# EAGLE design sparkfun-samd21g-r3 (EAGLE 7.1.0)
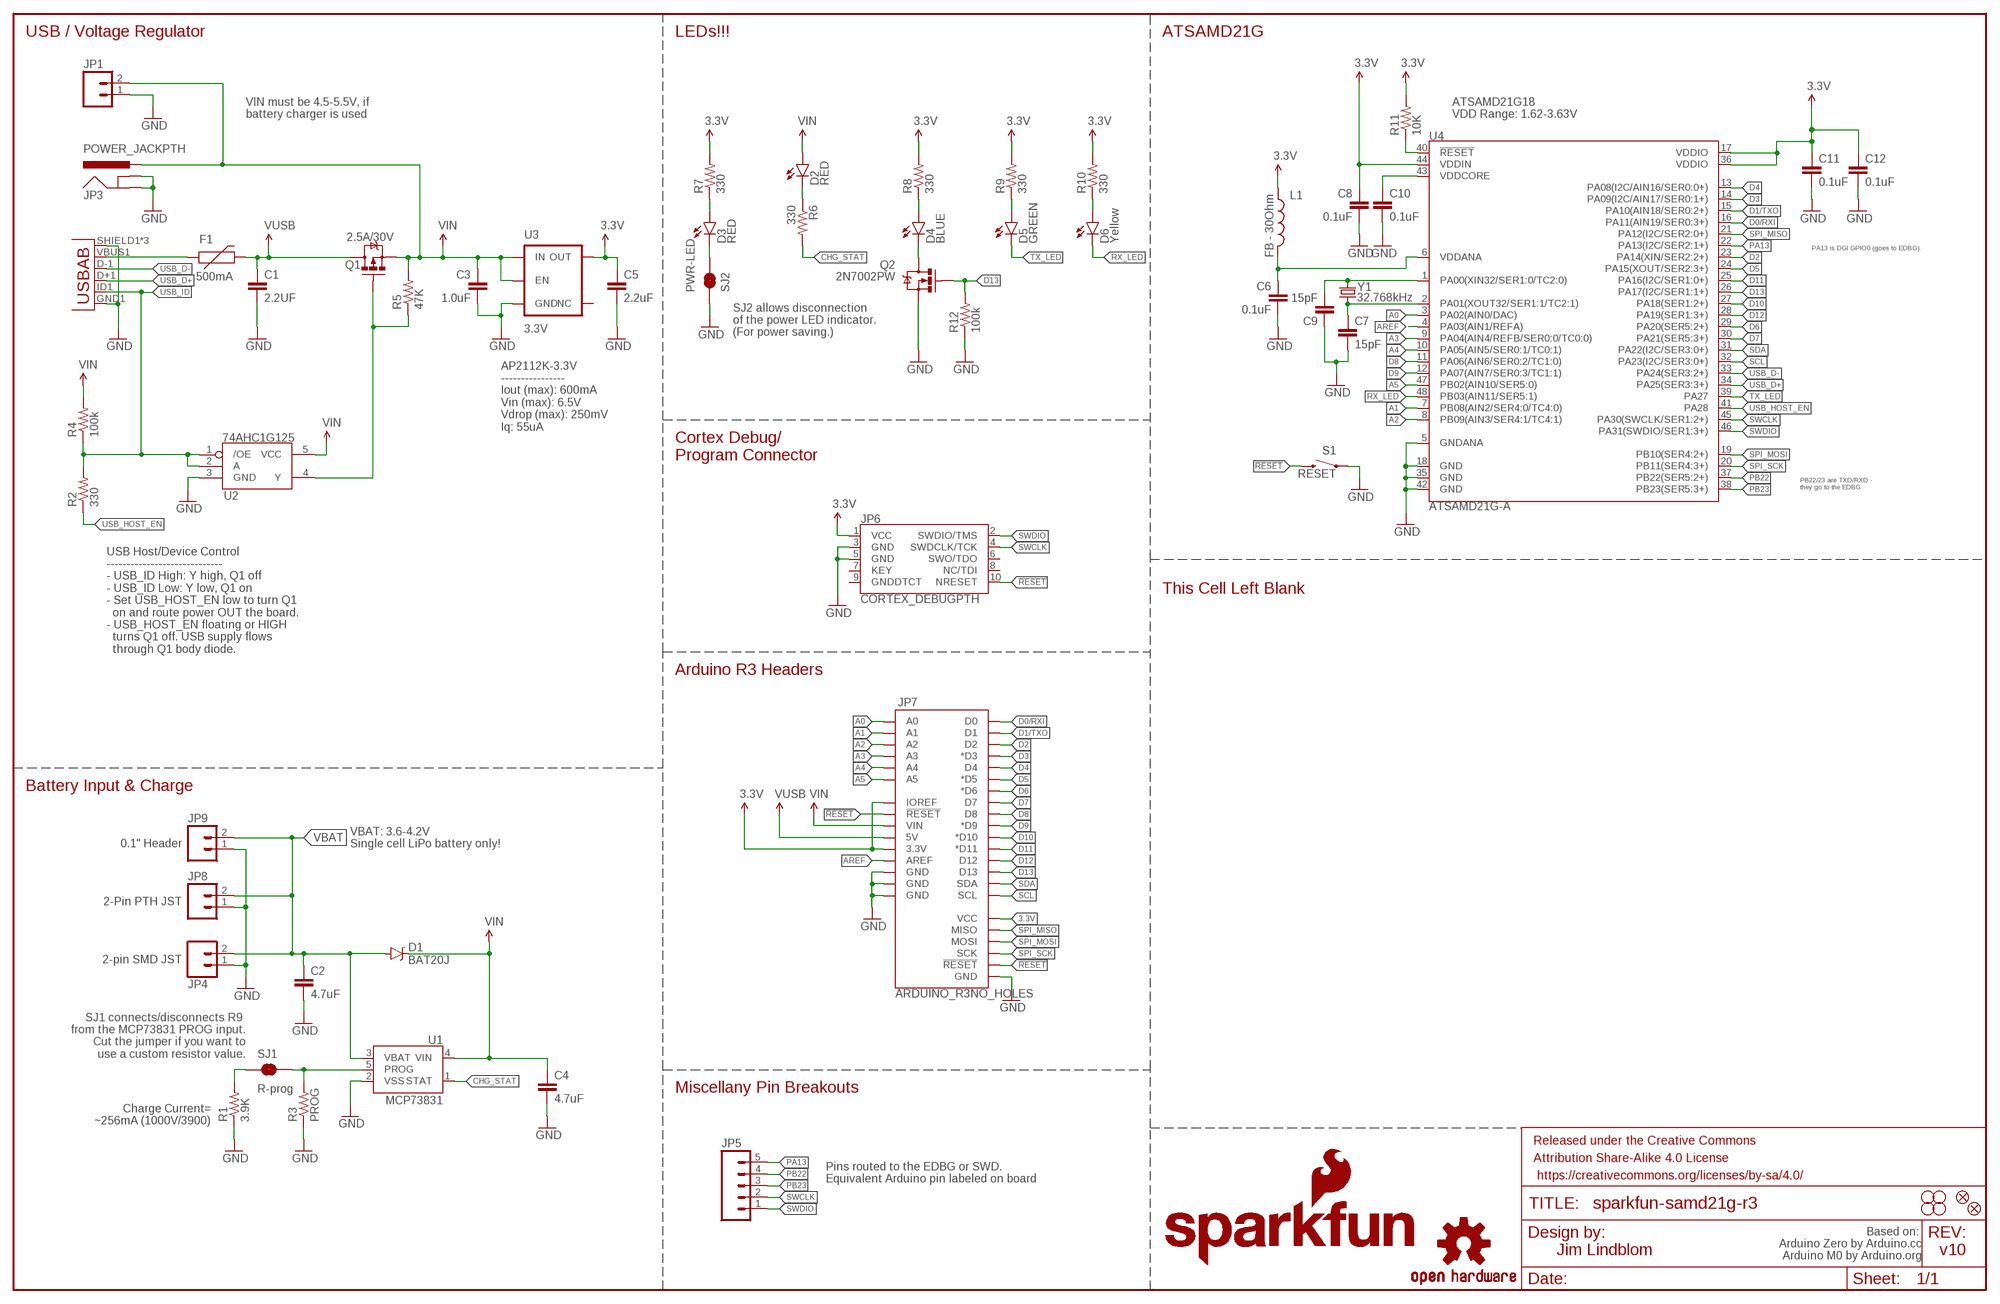
[diagram p0: schematic, sheet 1]

## Parts
C1  2.2UF  2.2UF50V10%(1206)  [1206]
C2  4.7uF  4.7UF-6.3V-10%(0603)0603  [0603-CAP]
C3  1.0uF  1.0UF-25V-+80/-20(0805)"  [0805-CAP]
C4  4.7uF  4.7UF-6.3V-10%(0603)0603  [0603-CAP]
C5  2.2uF  2.2UF-10V-20%(0603)  [0603-CAP]
C6  0.1uF  0.1UF-25V(+80/-20%)(0603)  [0603-CAP]
C7  15pF  15PF-50V-5%(0603)  [0603-CAP]
C8  0.1uF  0.1UF-25V(+80/-20%)(0603)  [0603-CAP]
C9  15pF  15PF-50V-5%(0603)  [0603-CAP]
C10  0.1uF  0.1UF-25V(+80/-20%)(0603)  [0603-CAP]
C11  0.1uF  0.1UF-25V(+80/-20%)(0603)  [0603-CAP]
C12  0.1uF  0.1UF-25V(+80/-20%)(0603)  [0603-CAP]
D1  BAT20J  DIODE-SCHOTTKY-BAT20J  [SOD-323]
D2  RED  LED-RED0603  [LED-0603]
D3  RED  LED-RED0603  [LED-0603]
D4  BLUE  LED-BLUE0603  [LED-0603]
D5  GREEN  LED-GREEN0603  [LED-0603]
D6  Yellow  LED-YELLOW0603  [LED-0603]
F1  500mA  PTCSMD  [PTC-1206]
FID1  FIDUCIAL1X2  [FIDUCIAL-1X2]
FID2  FIDUCIAL1X2  [FIDUCIAL-1X2]
FRAME1  FRAME-LEDGER  [CREATIVE_COMMONS]
JP1  M02PTH  [1X02]
JP2  USB-ABCONN-11794  [USB-AB-MICRO-SMD_V03]
JP3  POWER_JACKPTH  [POWER_JACK_PTH]
JP4  M02-JST-2MM-SMT  [JST-2-SMD]
JP5  M05NO_SILK  [1X05_NO_SILK]
JP6  CORTEX_DEBUGPTH  [2X5-PTH-1.27MM]
JP7  ARDUINO_R3NO_HOLES  [ARDUINO_R3_NO_HOLES]
JP8  M02-JST-2-PTH-NO_SILK  [JST-2-PTH-NS]
JP9  M021X02_NO_SILK  [1X02_NO_SILK]
L1  FB - 30Ohm  INDUCTOR0603  [0603]
LOGO1  SFE_LOGO_NAME_FLAME.2_INCH  [SFE_LOGO_NAME_FLAME_.2]
LOGO2  SFE_LOGO_NAME_FLAME.4_INCH  [SFE_LOGO_NAME_FLAME_.4]
LOGO3  OSHW-LOGOS  [OSHW-LOGO-S]
LOGO4  OSHW-LOGOL  [OSHW-LOGO-L]
Q1  2.5A/30V  MOSFET-PCHANNELDMG2307L  [SOT23-3]
Q2  2N7002PW  MOSFET-NCHANNEL2N7002PW  [SOT323]
R1  3.9K  3.9KOHM1/10W1%(0603)  [0603]
R2  330  330OHM1/10W1%(0603)  [0603-RES]
R3  PROG  RESISTORPTH-1/6W  [1/6W-RES]
R4  100k  100KOHM-1/10W-1%(0603)  [0603-RES]
R5  47K  47KOHM1/10W1%(0603)  [0603-RES]
R6  330  330OHM1/10W1%(0603)  [0603-RES]
R7  330  330OHM1/10W1%(0603)  [0603-RES]
R8  330  330OHM1/10W1%(0603)  [0603-RES]
R9  330  330OHM1/10W1%(0603)  [0603-RES]
R10  330  330OHM1/10W1%(0603)  [0603-RES]
R11  10K  10KOHM-1/10W-1%(0603)0603  [0603-RES]
R12  100k  100KOHM-1/10W-1%(0603)  [0603-RES]
S1  RESET  SWITCH-MOMENTARY-2SMD  [TACTILE-SWITCH-SMD]
SJ1  R-prog  JUMPER-PAD-2-NC_BY_TRACE  [PAD-JUMPER-2-NC_BY_TRACE_YES_SILK]
SJ2  PWR-LED  JUMPER-PAD-2-NC_BY_TRACENO_SILK  [PAD-JUMPER-2-NC_BY_TRACE_NO_SILK]
STANDOFF1  STAND-OFF  [STAND-OFF]
STANDOFF2  STAND-OFF  [STAND-OFF]
STANDOFF3  STAND-OFF  [STAND-OFF]
STANDOFF4  STAND-OFF  [STAND-OFF]
U1  MCP73831  [SOT23-5]
U2  74AHC1G125  [SOT23-5]
U3  3.3V  V_REG_AP2112K-3.3V  [SOT23-5]
U4  ATSAMD21G-A  [TQFP-48]
Y1  32.768kHz  CRYSTAL3.2X1.5MM  [CRYSTAL-SMD-3.2X1.5MM]

## Nets
3.3V: C5.1 C8.1 C11.1 C12.1 JP6.1(VCC) JP7.3.3V JP7.IOREF JP7.VCC L1.1 R7.2 R8.2 R9.2 R10.2 R11.2 U3.5(OUT) U4.17(VDDIO) U4.36(VDDIO) U4.44(VDDIN)
!RESET: JP6.10(NRESET) JP7.RESET@1(!RESET!) JP7.RESET@2(!RESET!) R11.1 S1.3 U4.40(!RESET!)
A0: JP7.A0 U4.3(PA02(AIN0/DAC))
A1: JP7.A1 U4.7(PB08(AIN2/SER4:0/TC4:0))
A2: JP7.A2 U4.8(PB09(AIN3/SER4:1/TC4:1))
A3: JP7.A3 U4.9(PA04(AIN4/REFB/SER0:0/TC0:0))
A4: JP7.A4 U4.10(PA05(AIN5/SER0:1/TC0:1))
A5: JP7.A5 U4.47(PB02(AIN10/SER5:0))
AREF: JP7.AREF U4.4(PA03(AIN1/REFA))
CHG_STAT: R6.2 U1.1(STAT)
D0/RXI: JP7.D0 U4.16(PA11(AIN19/SER0:3+))
D1/TXO: JP7.D1 U4.15(PA10(AIN18/SER0:2+))
D2: JP7.D2 U4.23(PA14(XIN/SER2:2+))
D3: JP7.D3(*D3) U4.14(PA09(I2C/AIN17/SER0:1+))
D4: JP7.D4 U4.13(PA08(I2C/AIN16/SER0:0+))
D5: JP7.D5(*D5) U4.24(PA15(XOUT/SER2:3+))
D6: JP7.D6(*D6) U4.29(PA20(SER5:2+))
D7: JP7.D7 U4.30(PA21(SER5:3+))
D8: JP7.D8 U4.11(PA06(AIN6/SER0:2/TC1:0))
D9: JP7.D9(*D9) U4.12(PA07(AIN7/SER0:3/TC1:1))
D10: JP7.D10(*D10) U4.27(PA18(SER1:2+))
D11: JP7.D11(*D11) U4.25(PA16(I2C/SER1:0+))
D12: JP7.D12 U4.28(PA19(SER1:3+))
D13: JP7.D13 Q2.1(G) R12.2 U4.26(PA17(I2C/SER1:1+))
GND: C1.2 C2.2 C3.2 C4.2 C5.2 C6.2 C7.2 C8.2 C9.1 C10.2 C11.2 C12.2 JP1.1 JP2.GND1(GND) JP2.SHIELD1(SHIELD) JP2.SHIELD2(SHIELD) JP2.SHIELD3(SHIELD) JP3.GND JP3.GNDBREAK JP4.1 JP6.3(GND) JP6.5(GND) JP7.GND@1(GND) JP7.GND@2(GND) JP7.GND@3(GND) JP7.GND@4(GND) JP8.1 JP9.1 Q2.2(S) R1.1 R3.1 R12.1 S1.1 SJ2.1 U1.2(VSS) U2.3(GND) U3.2(GND) U4.5(GNDANA) U4.18(GND) U4.35(GND) U4.42(GND)
N$1: F1.1 JP2.VBUS1(VBUS)
N$2: C9.2 U4.1(PA00(XIN32/SER1:0/TC2:0)) Y1.P$2
N$3: D4.C Q2.3(D)
N$4: C7.1 U4.2(PA01(XOUT32/SER1:1/TC2:1)) Y1.P$1
N$5: D3.A R7.1
N$6: D4.A R8.1
N$8: D2.C R6.1
N$10: D5.A R9.1
N$11: D6.A R10.1
N$12: D3.C SJ2.2
N$13: R1.2 SJ1.1
N$15: R3.2 SJ1.2 U1.5(PROG)
PA13: JP5.5 U4.22(PA13(I2C/SER2:1+))
PB22: JP5.4 U4.37(PB22(SER5:2+))
PB23: JP5.3 U4.38(PB23(SER5:3+))
RX_LED: D6.C U4.48(PB03(AIN11/SER5:1))
SCL: JP7.SCL U4.32(PA23(I2C/SER3:0+))
SDA: JP7.SDA U4.31(PA22(I2C/SER3:0+))
SPI_MISO: JP7.MISO U4.21(PA12(I2C/SER2:0+))
SPI_MOSI: JP7.MOSI U4.19(PB10(SER4:2+))
SPI_SCK: JP7.SCK U4.20(PB11(SER4:3+))
SWCLK: JP5.2 JP6.4(SWDCLK/TCK) U4.45(PA30(SWCLK/SER1:2+))
SWDIO: JP5.1 JP6.2(SWDIO/TMS) U4.46(PA31(SWDIO/SER1:3+))
TX_LED: D5.C U4.39(PA27)
USB_D+: JP2.D+1(D+) U4.34(PA25(SER3:3+))
USB_D-: JP2.D-1(D-) U4.33(PA24(SER3:2+))
USB_HOST_EN: R2.1 U4.41(PA28)
USB_HOST_POWER_EN: Q1.1(G) R5.1 U2.4(Y)
USB_ID: JP2.ID1(USBID) R2.2 R4.1 U2.1(/OE) U2.2(A)
VBAT: C2.1 D1.A JP4.2 JP8.2 JP9.2 U1.3(VBAT)
VDDANA: C6.1 L1.2 U4.6(VDDANA)
VDDCORE: C10.1 U4.43(VDDCORE)
VIN: C3.1 C4.1 D1.C D2.A JP1.2 JP3.PWR JP7.VIN Q1.2(S) R4.2 R5.2 U1.4(VIN) U2.5(VCC) U3.1(IN) U3.3(EN)
VUSB: C1.1 F1.2 JP7.5V Q1.3(D)
Unconnected: JP6.6(SWO/TDO) JP6.7(KEY) JP6.8(NC/TDI) JP6.9(GNDDTCT) U3.4(NC)

## Notes on the sheet
- USB / Voltage Regulator | LEDs!!! | ATSAMD21G
- VIN must be 4.5-5.5V, if 
  battery charger is used
- ATSAMD21G18
  VDD Range: 1.62-3.63V
- PA13 is DGI GPIO0 (goes to EDBG).
- SJ2 allows disconnection
  of the power LED indicator.
  (For power saving.)
- AP2112K-3.3V
  ----------------
  Iout (max): 600mA 
  Vin (max): 6.5V
  Vdrop (max): 250mV
  Iq: 55uA
- Cortex Debug/
  Program Connector
- PB22/23 are TXD/RXD - 
  they go to the EDBG
- USB Host/Device Control
  -----------------------------
  - USB_ID High: Y high, Q1 off
  - USB_ID Low: Y low, Q1 on
  - Set USB_HOST_EN low to turn Q1
    on and route power OUT the board.
  - USB_HOST_EN floating or HIGH
    turns Q1 off. USB supply flows
    through Q1 body diode.
- This Cell Left Blank
- Arduino R3 Headers
- Battery Input & Charge
- VBAT: 3.6-4.2V
  Single cell LiPo battery only\!
- 0.1" Header
- 2-Pin PTH JST
- 2-pin SMD JST
- SJ1 connects/disconnects R9 
  from the MCP73831 PROG input.
  Cut the jumper if you want to
  use a custom resistor value.
- Miscellany Pin Breakouts
- Charge Current=
  ~256mA (1000V/3900)
- Pins routed to the EDBG or SWD.
  Equivalent Arduino pin labeled on board
- Based on: 
  Arduino Zero by Arduino.cc
  Arduino M0 by Arduino.org
- Jim Lindblom | v10

## Library data of the parts
C1 = SparkFun-Capacitors:2.2UF50V10%(1206): CAP-10009; PROD_ID: CAP-10009
C2 C4 = SparkFun-Capacitors:4.7UF-6.3V-10%(0603): CAP-08280; PROD_ID: CAP-08280
C3 = SparkFun-Capacitors:1.0UF-25V-+80/-20(0805): CAP-11625; PROD_ID: CAP-11625
C5 = SparkFun-Capacitors:2.2UF-10V-20%(0603): CAP-07888; PROD_ID: CAP-07888
C6 C8 C10-C12 = SparkFun-Capacitors:0.1UF-25V(+80/-20%)(0603): CAP-00810 Ceramic Standard decoupling cap; PROD_ID: CAP-00810
C7 C9 = SparkFun-Capacitors:15PF-50V-5%(0603): CAP-07881; PROD_ID: CAP-07881
D1 = SparkFun-DiscreteSemi:DIODE-SCHOTTKY: Schottky diodes in SFE's production catalog BAT20J 1A 23V 0.62Vf RB751 120mA 40V 0.37Vf PMEG4005EJ 0.5A 40V 0.42Vf MBRA140 1A 40V 0.5Vf B340A 3A 40V SMA; PROD_ID: DIO-11623
D2 D3 = SparkFun-LED:LED-RED: Assorted Red LEDs LilyPad 1206- DIO-09912 1206- DIO-00809 0603- DIO-00819 "SMART" means more efficient and expensive; PROD_ID: DIO-00819
D4 = SparkFun-LED:LED-BLUE: Blue LEDs for production use Various blue LEDs stocked by SparkFun production 0603 - DIO-08575 Rebel - DIO-09553 1206 - DIO-09911; PROD_ID: DIO-08575
D5 = SparkFun-LED:LED-GREEN: Various green LEDs Green LEDs used in SFE Production 0603- DIO-00821 LARGE- DIO-00862 LILYPAD- DIO-09910; PROD_ID: DIO-00821
D6 = SparkFun-LED:LED-YELLOW: Yellow SMD LEDs LilyPad 1206- DIO-09909 0603- DIO-09003 "SMART" means more efficient and expensive; PROD_ID: DIO-09003
F1 = SparkFun-PowerIC:PTC: Resettable Fuse PTC Resettable Fuse. Spark Fun Electronics SKU : COM-08357; PROD_ID: RES-11150
FID1 FID2 = SparkFun-Aesthetics:FIDUCIAL: Fiducial Alignment Points Various fiducial points for machine vision alignment.
FRAME1 = SparkFun-Aesthetics:FRAME-LEDGER: Schematic Frame Standard 11x14 US Ledger frame
JP1 JP8 JP9 = SparkFun-Connectors:M02: Standard 2-pin 0.1" header. Use with - straight break away headers ( PRT-00116) - right angle break away headers (PRT-00553) - swiss pins (PRT-00743) - machine pins (PRT-00117) - female headers (PRT-00115) Molex polarized connector foot print use with: PRT-08233 with associated crimp pins and housings. 2.54_SCREWTERM for use with PRT-10571. 3.5mm Screw Terminal footprints for PRT-08084 5mm Screw Terminal footprints for use with PRT-08432
JP2 = SparkFun-Connectors:USB-AB: This is a USB AB connector that is compatible with USB OTG. i.e. this connector can serve as a host or device; PROD_ID: CONN-11794
JP3 = SparkFun-Connectors:POWER_JACK: Power Jack This is the standard 5.5mm barrel jack for power. The PTH is the most common, proven, reliable, footprint. The Slot footprint only works if the mill layer is transmitted to the PCB fab house so be warned. Mating wall wart : TOL-00298 (and others); PROD_ID: CONN-08197
JP4 = SparkFun-Connectors:M02: Standard 2-pin 0.1" header. Use with - straight break away headers ( PRT-00116) - right angle break away headers (PRT-00553) - swiss pins (PRT-00743) - machine pins (PRT-00117) - female headers (PRT-00115) Molex polarized connector foot print use with: PRT-08233 with associated crimp pins and housings. 2.54_SCREWTERM for use with PRT-10571. 3.5mm Screw Terminal footprints for PRT-08084 5mm Screw Terminal footprints for use with PRT-08432; PROD_ID: CONN-11443
JP5 = SparkFun-Connectors:M05: Header 5 Standard 5-pin 0.1" header. Use with straight break away headers (SKU : PRT-00116), right angle break away headers (PRT-00553), swiss pins (PRT-00743), machine pins (PRT-00117), and female headers (PRT-00115). Molex polarized connector foot print use with SKU : PRT-08230 with associated crimp pins and housings.
JP6 = samd21-temp:CORTEX_DEBUG: Cortex Debug Connector Datasheet <http://infocenter.arm.com/help/topic/com.arm.doc.faqs/attached/13634/cortex_debug_connectors.pdf>
JP7 = SparkFun-Boards:ARDUINO_R3: Arduino R3 Footprint (w/ SPI header)
L1 = SparkFun-Passives:INDUCTOR: Inductors Basic Inductor/Choke - 0603 and 1206. Footprints are not proven and vary greatly between part numbers. INDUCTOR POWER 3.3UH 4.0A SMD 0.197" L x 0.197" W x 0.177" H (5.00mm x 5.00mm x 4.50mm); PROD_ID: RES-07859
LOGO1 LOGO2 = SparkFun-Aesthetics:SFE_LOGO_NAME_FLAME: SFE Logo, name and flame This is the SparkFun full logo. The logo on the schematic will always be the same size; the package variant is the height of the flame part of the logo. Default layer for the logo on the board is tSilk.
LOGO3 LOGO4 = SparkFun-Aesthetics:OSHW-LOGO: Open Source Hardware Logo This logo indicates the piece of hardware it is found on incorporates a OSHW license and/or adheres to the definition of open source hardware found here: http://freedomdefined.org/OSHW
Q1 = SparkFun-DiscreteSemi:MOSFET-PCHANNEL: Generic PMOSFET IRLML2244 - TRANS-11153 (SOT-23 -20V -4.3A) (1.Gate 2.Source 3.Drain) FQP27P06 - COM-10349 <http://www.sparkfun.com/products/10349> (TO-220 -60V -27A) (1.Gate 2.Source 3.Drain); PROD_ID: TRANS-11308
Q2 = SparkFun-DiscreteSemi:MOSFET-NCHANNEL: Common NMOSFET Parts MFG P/N Store ID Prod ID FDD8780 TRANS-09984 SI7820DN TRANS-11055 FDS6630A IC-08089 2N7002PW TRANS-11151 FQP30N06L COM-10213 TRANS-10060 BSS123LT1G TRANS-08345 BSS138 TRANS-00830 BS170 2N7000; PROD_ID: TRANS-11151
R1 = SparkFun-Resistors:3.9KOHM1/10W1%(0603): RES-08701; PROD_ID: RES-08701
R2 R6-R10 = SparkFun-Resistors:330OHM1/10W1%(0603): RES-00818; PROD_ID: RES-00818
R3 = SparkFun-Passives:RESISTOR: Resistor Basic schematic elements and footprints for 0603, 1206, and PTH resistors.
R4 R12 = SparkFun-Resistors:100KOHM-1/10W-1%(0603): RES-07828; PROD_ID: RES-07828
R5 = SparkFun-Resistors:47KOHM1/10W1%(0603): RES-07871; PROD_ID: RES-07871
R11 = SparkFun-Resistors:10KOHM-1/10W-1%(0603): RES-00824; PROD_ID: RES-00824
S1 = SparkFun-Electromechanical:SWITCH-MOMENTARY-2: Various NO switches- pushbuttons, reed, etc; PROD_ID: SWCH-08247
SJ1 SJ2 = SparkFun-Passives:JUMPER-PAD-2-NC_BY_TRACE
STANDOFF1-STANDOFF4 = SparkFun-Electromechanical:STAND-OFF: #4 Stand Off This is the mechanical footprint for a #4 phillips button head screw. Use the keepout ring to avoid running the screw head into surrounding components. SKU : PRT-00447
U1 = SparkFun-PowerIC:MCP73831: Miniature single cell, fully integrated Li-Ion, Li-polymer charge management controller http://ww1.microchip.com/downloads/en/DeviceDoc/20001984g.pdf IC-09995; PROD_ID: IC-09995
U2 = SparkFun-DigitalIC:74AHC1G125: Single bus buffer gate with 3-state output; PROD_ID: IC-11920
U3 = SparkFun-PowerIC:V_REG_AP2112: AP2112 - 600mA CMOS LDO Regulator w/ Enable The AP2112 is CMOS process low dropout linear regulator with enable function, the regulator delivers a guaranteed 600mA (min.) continuous load current. Features Output Voltage Accuracy: ±1.5% Output Current: 600mA (Min.) Foldback Short Current Protection: 50mA Enable Function to Turn ON/OFF VOUT Low Dropout Voltage (3.3V): 250mV (Typ.) @IOUT=600mA Excellent Load Regulation: 0.2%/A (Typ.) Excellent Line Regulation: 0.02%/V (Typ.) Low Quiescent Current: 55μA (Typ.) Low Standby Current: 0.01μA (Typ.) Low Output Noise: 50μVRMS PSRR: 100Hz -65dB, 1kHz -65dB OTSD Protection Stable with 1.0μF Flexible Cap: Ceramic, Tantalum and Aluminum Electrolytic Operation Temperature Range: -40°C to 85°C ESD: MM 400V, HBM 4000V; PROD_ID: VREG-12457
U4 = samd21-temp:ATSAMD21G: Atmel SAMD21G SMART ARM-Based Microcontroller The Atmel ® | SMART ™ SAM D21 is a series of low-power microcontrollers using the 32-bit ARM ® Cortex ® -M0+ processor, and ranging from 32- to 64-pins with up to 256KB Flash and 32KB of SRAM. The SAM D21 devices operate at a maximum frequency of 48MHz and reach 2.46 CoreMark/MHz. They are designed for simple and intuitive migration with identical peripheral modules, hex compatible code, identical linear address map and pin compatible migration paths between all devices in the product series. All devices include intelligent and flexible peripherals, Atmel Event System for inter-peripheral signaling, and support for capacitive touch button, slider and wheel user interfaces.; PROD_ID: IC-13064
Y1 = samd21-temp:CRYSTAL: Various standard crystals. Proven footprints.; PROD_ID: XTAL-13062

## Board
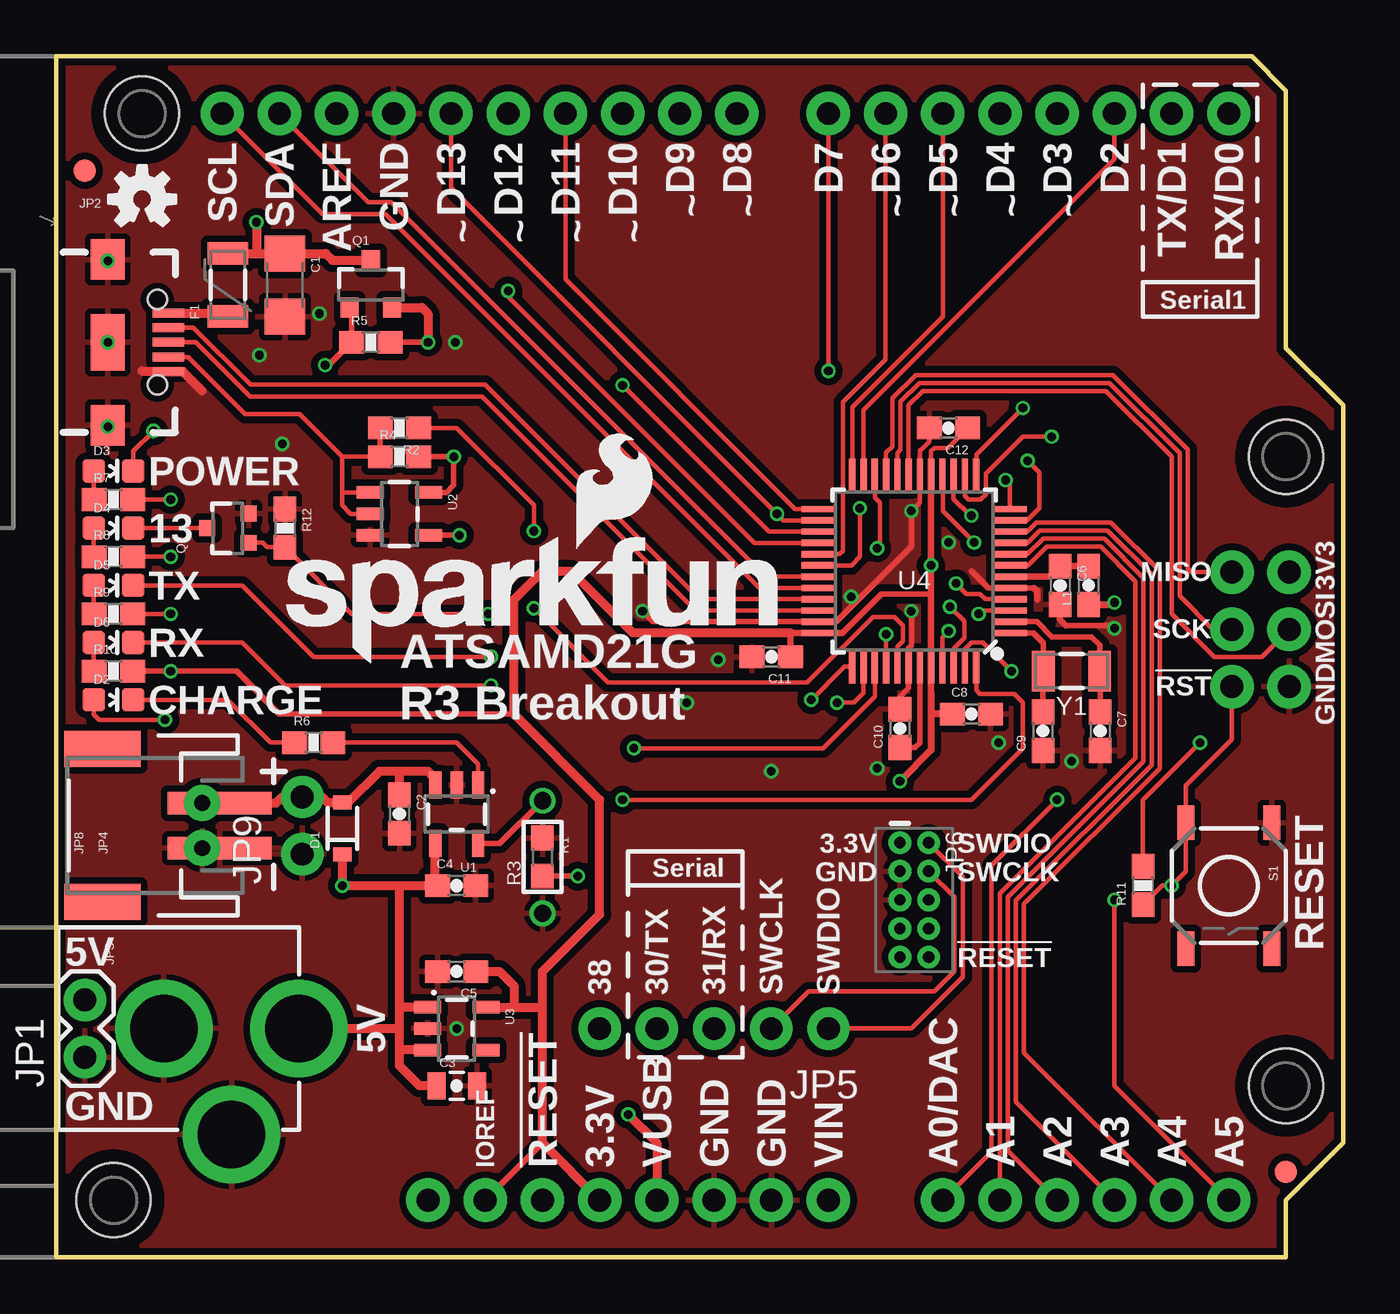
[diagram p1: board, top side]
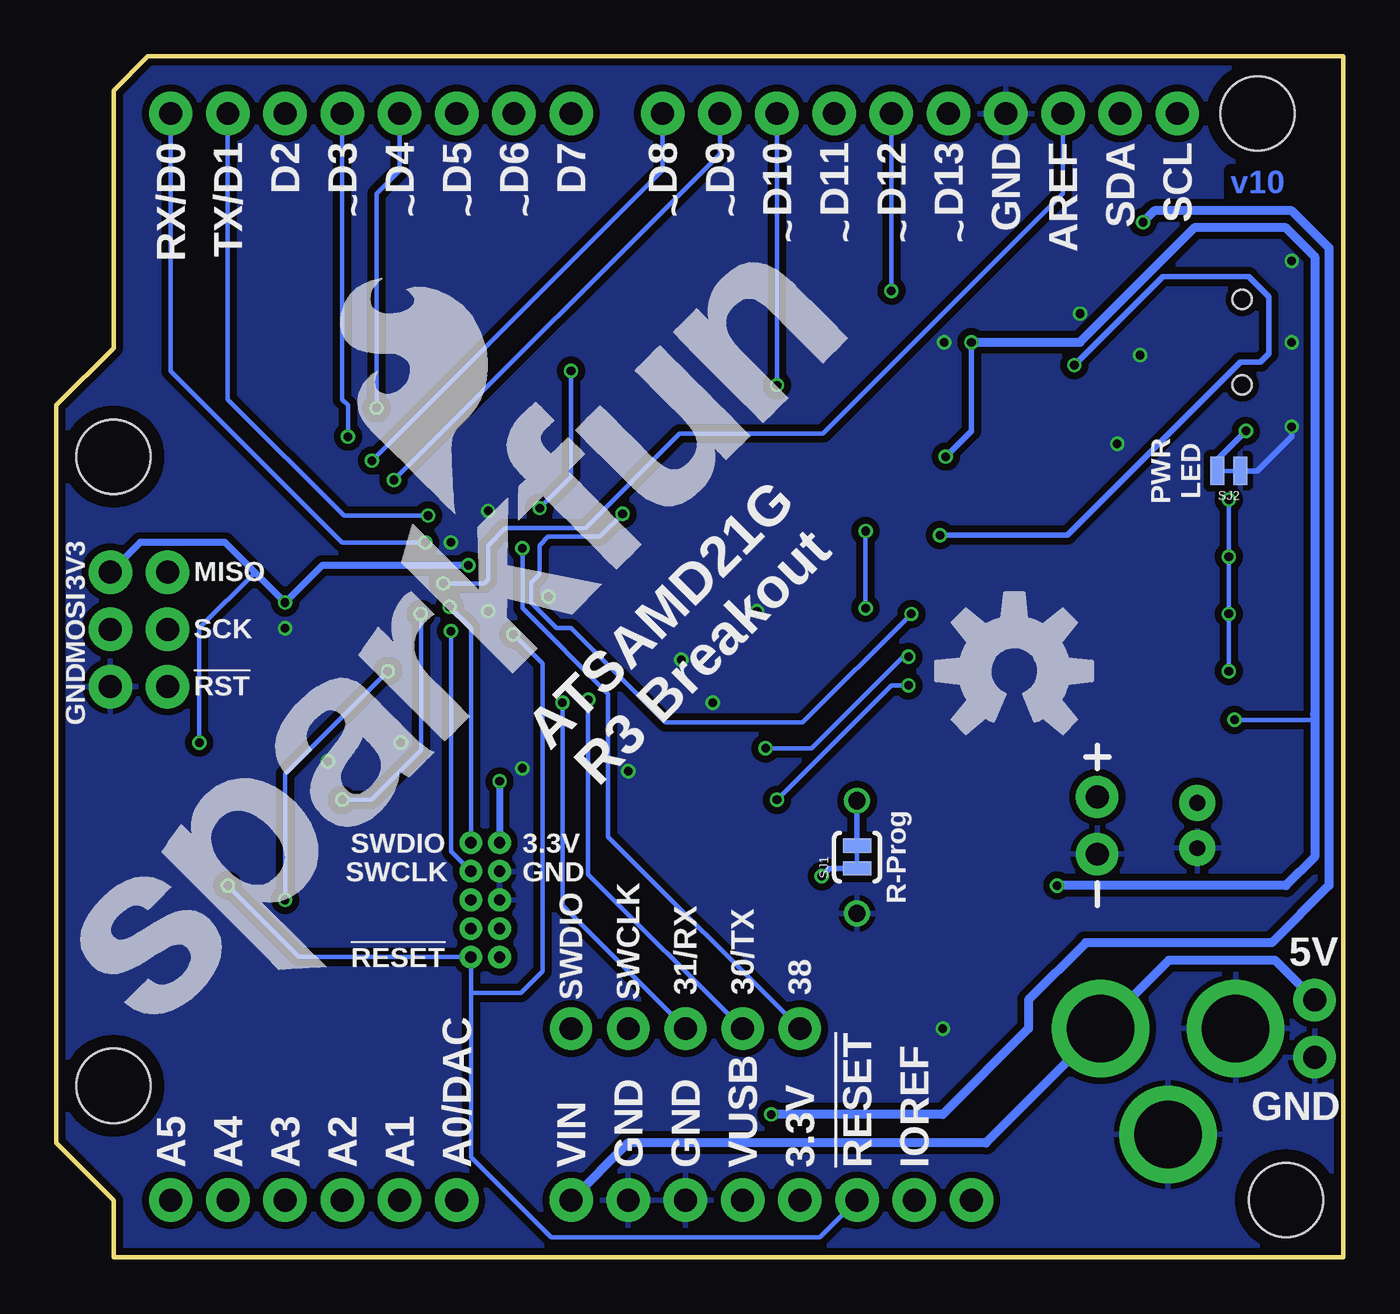
[diagram p2: board, bottom side, seen from below]

Size 57.15 x 53.34 mm. Coordinates in mm from the lower left corner, seen from the top.
Outline: 0,53.34 0,0 54.61,0 54.61,2.54 57.15,5.08 57.15,37.85 54.61,40.39 54.61,51.82 53.09,53.34 0,53.34
Copper layers (1*16): Top 0.035mm / dielectric 1.5mm / Bottom 0.035mm
Design rules "Gold_Phoenix_Standard_Spec_2_layer": minimum track width 5mil, minimum drill 6mil, track to track 5mil, track to pad 5mil, pad to pad 5mil, via to via 5mil, smd to smd 5mil, copper to edge 8mil, drill to drill 8mil, minimum pad ring 5mil, minimum via ring 5mil, stop-mask expansion 4mil, vias tented up to drill 20mil, thermal gap 10mil

### Footprints (pad centres in the part's own frame; a part is rotated, then mirrored left to right if it is on the bottom)
1206 = smd 1.6 x 1.8: 1 -1.4,0; 2 1.4,0
0603-CAP = smd 1.1 x 1: 1 -0.85,0; 2 0.85,0
0805-CAP = smd 0.8 x 1.2: 1 -0.9,0; 2 0.9,0
SOD-323 = smd 0.63 x 0.83: A 1.15,0; C -1.15,0
LED-0603 = smd 1 x 1: A 0,-0.877; C 0,0.877
PTC-1206 = smd 1 x 1.8: 1 -1.4,0; 2 1.4,0
FIDUCIAL-1X2 = smd 1 x 1: 1 0,0
1X02 = drill 1.016 pad 1.88: 1 0,0; 2 2.54,0
USB-AB-MICRO-SMD_V03 = smd 1.4 x 0.4: D+1 2.7,0; D-1 2.7,0.65; GND1 2.7,-1.3; ID1 2.7,-0.65; VBUS1 2.7,1.3 | smd 1.5 x 1.8: SHIELD1 0,3.68; SHIELD3 0,-3.68 | smd 1.5 x 2.5: SHIELD2 0,0 | hole 0.85: 2.2,1.9; 2.2,-1.9
POWER_JACK_PTH = drill 2.997 pad 4.318: GND 0,7.7; GNDBREAK 4.7,10.7; PWR 0,13.7
JST-2-SMD = smd 1 x 4.6: 1 -1,-3.7; 2 1,-3.7 | smd 1.6 x 3.4: NC1 -3.4,1.5; NC2 3.4,1.5
1X05_NO_SILK = drill 1.016 pad 1.88: 1 0,0; 2 2.54,0; 3 5.08,0; 4 7.62,0; 5 10.16,0
2X5-PTH-1.27MM = drill 0.508 pad 1: 1 -2.54,-0.635; 2 -2.54,0.635; 3 -1.27,-0.635; 4 -1.27,0.635; 5 0,-0.635; 6 0,0.635; 7 1.27,-0.635; 8 1.27,0.635; 9 2.54,-0.635; 10 2.54,0.635
ARDUINO_R3_NO_HOLES = drill 1.016 pad 1.93: 3.3V 35.56,2.54; 5V 38.1,2.54; A0 50.8,2.54; A1 53.34,2.54; A2 55.88,2.54; A3 58.42,2.54; A4 60.96,2.54; A5 63.5,2.54; AREF 23.876,50.8; D0 63.5,50.8; D1 60.96,50.8; D2 58.42,50.8; D3 55.88,50.8; D4 53.34,50.8; D5 50.8,50.8; D6 48.26,50.8; D7 45.72,50.8; D8 41.656,50.8; D9 39.116,50.8; D10 36.576,50.8; D11 34.036,50.8; D12 31.496,50.8; D13 28.956,50.8; GND@1 40.64,2.54; GND@2 43.18,2.54; GND@3 26.416,50.8; GND@4 66.18,25.35; IOREF 30.48,2.54; MISO 63.64,30.43; MOSI 66.18,27.89; NC 27.94,2.54; RESET@1 33.02,2.54; RESET@2 63.64,25.35; SCK 63.64,27.89; SCL 18.796,50.8; SDA 21.336,50.8; VCC 66.18,30.43; VIN 45.72,2.54
JST-2-PTH-NS = drill 0.7 pad 1.6: 1 -1,0; 2 1,0
1X02_NO_SILK = drill 1.016 pad 1.88: 1 0,0; 2 2.54,0
0603 = smd 1.1 x 1: 1 -0.85,0; 2 0.85,0
SOT23-3 = smd 0.8 x 0.9: 1 -0.95,-1; 2 0.95,-1; 3 0,1.1
SOT323 = smd 0.7 x 0.7: 1 -0.65,-0.925; 2 0.65,-0.925; 3 0,0.925
0603-RES = smd 1.1 x 1: 1 -0.85,0; 2 0.85,0
1/6W-RES = drill 0.762: 1 -2.5,0; 2 2.5,0
TACTILE-SWITCH-SMD = smd 1.524 x 0.762: 1 -2.794,1.905; 2 2.794,1.905; 3 -2.794,-1.905; 4 2.794,-1.905
PAD-JUMPER-2-NC_BY_TRACE_YES_SILK = smd 0.635 x 1.27: 1 -0.508,0; 2 0.508,0
PAD-JUMPER-2-NC_BY_TRACE_NO_SILK = smd 0.635 x 1.27: 1 -0.508,0; 2 0.508,0
STAND-OFF = hole 3.302: 0,0
SOT23-5 = smd 0.55 x 1.2: 1 -0.95,-1.3; 2 0,-1.3; 3 0.95,-1.3; 4 0.95,1.3; 5 -0.95,1.3
TQFP-48 = smd 1.5 x 0.28: 1 -4.25,2.75; 2 -4.25,2.25; 3 -4.25,1.75; 4 -4.25,1.25; 5 -4.25,0.75; 6 -4.25,0.25; 7 -4.25,-0.25; 8 -4.25,-0.75; 9 -4.25,-1.25; 10 -4.25,-1.75; 11 -4.25,-2.25; 12 -4.25,-2.75; 25 4.25,-2.75; 26 4.25,-2.25; 27 4.25,-1.75; 28 4.25,-1.25; 29 4.25,-0.75; 30 4.25,-0.25; 31 4.25,0.25; 32 4.25,0.75; 33 4.25,1.25; 34 4.25,1.75; 35 4.25,2.25; 36 4.25,2.75 | smd 0.28 x 1.5: 13 -2.75,-4.25; 14 -2.25,-4.25; 15 -1.75,-4.25; 16 -1.25,-4.25; 17 -0.75,-4.25; 18 -0.25,-4.25; 19 0.25,-4.25; 20 0.75,-4.25; 21 1.25,-4.25; 22 1.75,-4.25; 23 2.25,-4.25; 24 2.75,-4.25; 37 2.75,4.25; 38 2.25,4.25; 39 1.75,4.25; 40 1.25,4.25; 41 0.75,4.25; 42 0.25,4.25; 43 -0.25,4.25; 44 -0.75,4.25; 45 -1.25,4.25; 46 -1.75,4.25; 47 -2.25,4.25; 48 -2.75,4.25
CRYSTAL-SMD-3.2X1.5MM = smd 1 x 1.8: P$1 -1.25,0; P$2 1.25,0

### Placement (x,y rotation side)
C1  10.16,43.18 270 top
C2  15.24,19.68 270 top
C3  17.78,7.62 0 top
C4  17.78,16.51 0 top
C5  17.78,12.7 180 top
C6  44.58,29.84 270 top
C7  46.35,23.37 270 top
C8  40.64,24.13 0 top
C9  43.81,23.37 90 top
C10  37.47,23.5 90 top
C11  31.75,26.67 180 top
C12  39.62,36.83 180 top
D1  12.7,19.05 90 top
D2  2.54,24.77 270 top
D3  2.54,34.92 270 top
D4  2.54,32.38 270 top
D5  2.54,29.84 270 top
D6  2.54,27.3 270 top
F1  7.62,43.18 90 top
FID1  1.27,48.26 0 top
FID2  54.61,3.81 0 top
FRAME1  3.81,-29.21 0 top  (outside the outline)
JP1  1.27,8.89 90 top
JP2  2.29,40.64 0 top
JP3  -2.92,10.16 270 top
JP4  3.56,19.18 90 top
JP5  34.29,10.16 180 top
JP6  38.1,15.88 270 top
JP7  -11.43,0 0 top
JP8  6.48,19.18 90 top
JP9  10.92,17.91 90 top
L1  45.85,29.84 90 top
LOGO1  9.53,26.29 0 top
LOGO2  50.8,6.99 45 bottom
LOGO3  3.81,46.99 0 top
LOGO4  14.61,26.04 0 bottom
Q1  13.97,43.18 0 top
Q2  7.62,32.38 90 top
R1  21.59,17.78 270 top
R2  15.24,36.83 180 top
R3  21.59,17.78 90 top
R4  15.24,35.56 0 top
R5  13.97,40.64 0 top
R6  11.43,22.86 0 top
R7  2.54,33.66 0 top
R8  2.54,31.11 0 top
R9  2.54,28.57 0 top
R10  2.54,26.04 0 top
R11  48.26,16.51 90 top
R12  10.16,32.38 270 top
S1  52.07,16.51 270 top
SJ1  21.59,17.78 90 bottom
SJ2  5.08,34.92 180 bottom
STANDOFF1  54.61,7.62 0 top
STANDOFF2  3.81,50.8 0 top
STANDOFF3  2.54,2.54 0 top
STANDOFF4  54.61,35.56 0 top
U1  17.78,19.68 180 top
U2  15.24,33.02 270 top
U3  17.78,10.16 270 top
U4  38.1,30.48 180 top
Y1  45.09,26.04 180 top

### Tracks (layer width: path | path; a pad name or v marks a point on that pad's centre or on a via)
3.3V  (via drill 0.38)
  Top 0.203: U4.17 38.85,35.8 38.99,35.94 39.59,35.94 C12.1 | R11.2 48.26,20.32 v50.8,22.86 | R7.2 v5.08,33.66 | v5.08,31.11 R8.2 | R9.2 v5.08,28.57
  Top 0.254: 34.91,27.73 36.64,29.46 38.85,29.46 | 20.32,24.13 9.91,24.13 8,26.04 v5.08,26.04 R10.2 | JP7.IOREF 21.59,5.08
  Top 0.279: U4.17 v38.85,30.73 38.85,29.46 U4.44 38.85,25.07 | 34.91,27.73 U4.36 32.6,27.73 C11.1
  Top 0.305: L1.1 46.9,29 v46.99,29.08 | 38.85,25.07 38.85,24.13 | 38.85,24.13 38.85,22.53 v37.47,21.14 | C8.1 38.85,24.13
  Top 0.406: 32.6,27.73 25.61,27.73 22.86,30.48 21.59,30.48 20.32,29.21 20.32,24.13 24.13,20.32 24.13,15.24 21.59,12.7 21.59,11.11 | U3.5 20.32,11.11 | 20.32,11.11 21.59,11.11 | C5.1 19.68,12.7 20.32,12.06 20.32,11.11 | JP7.3.3V 21.59,5.08 21.59,11.11
  Bottom 0.203: v50.8,22.86 50.8,27.94 48.32,30.42 | v5.08,33.66 v5.08,31.11 v5.08,28.57 v5.08,26.04
  Bottom 0.305: v38.85,30.73 45.34,30.73 v46.99,29.08 48.32,30.42 49.66,31.75 53.43,31.75 JP7.VCC | v37.47,21.14 JP6.1
!RESET  (via drill 0.38)
  Top 0.203: U4.40 v36.85,27.67 | R11.1 49.11,16.51 v49.53,16.51 50.16,17.14 S1.3 50.16,20.95 52.21,23 JP7.RESET@2
  Bottom 0.203: 38.73,11.75 36.51,11.75 35.56,12.7 35.56,26.38 v36.85,27.67 | v49.53,16.51 46.35,13.34 JP6.10 38.73,11.75 | JP7.RESET@1 23.24,0.89 35.18,0.89 38.73,4.45 38.73,11.75
A0  (via drill 0.38)
  Top 0.203: U4.3 41.11,28.73 v40.96,28.57 | v44.45,20.32 41.53,17.4 41.53,4.7 JP7.A0
  Bottom 0.203: v40.96,28.57 40.96,22.54 43.18,20.32 v44.45,20.32
A1
  Top 0.203: JP7.A1 41.91,16.15 47.93,22.17 47.93,30.02 46.38,31.57 43.98,31.57 43.14,30.73 U4.7
A2
  Top 0.203: JP7.A2 42.27,4.72 42.27,16 48.28,22.02 48.28,30.18 46.53,31.93 43.83,31.93 43.13,31.23 U4.8
A3
  Top 0.203: JP7.A3 42.62,6.91 42.62,15.85 48.64,21.87 48.64,30.33 46.69,32.28 43.67,32.28 43.12,31.73 U4.9
A4
  Top 0.203: U4.10 43.11,32.23 43.52,32.64 46.84,32.64 49,30.48 49,21.72 42.98,15.7 42.98,9.09 JP7.A4
A5  (via drill 0.38)
  Top 0.203: U4.47 40.35,27.02 40.64,27.3 41.15,27.3 v42.42,26.04 | v46.99,15.88 46.99,7.62 JP7.A5
  Bottom 0.203: v42.42,26.04 46.99,21.46 v46.99,15.88
AREF  (via drill 0.38)
  Top 0.203: U4.4 41.26,29.23 41.02,29.46 40.43,29.46 v39.96,29.93
  Bottom 0.203: JP7.AREF 12.45,47.24 23.11,36.58 29.46,36.58 33.66,32.38 37.21,32.38 37.97,31.62 37.97,30.1 38.14,29.93 v39.96,29.93
CHG_STAT
  Top 0.203: U1.1 18.73,21.91 17.78,22.86 R6.2
D0/RXI  (via drill 0.38)
  Top 0.203: U4.16 39.37,34.71 39.37,33.15 v40.77,31.75
  Bottom 0.203: JP7.D0 52.07,39.37 44.45,31.75 v40.77,31.75
D1/TXO  (via drill 0.38)
  Top 0.203: U4.15 39.85,33.68 40.59,32.94 v40.64,32.94
  Bottom 0.203: JP7.D1 49.53,38.1 44.37,32.94 v40.64,32.94
D2
  Top 0.203: U4.23 35.85,37.63 46.99,48.77 JP7.D2
D3  (via drill 0.38)
  Top 0.203: U4.14 40.35,33.82 40.51,33.66 41.05,33.66 41.27,33.88 41.27,34.8 42.93,36.45 v44.2,36.45
  Bottom 0.203: v44.2,36.45 44.2,37.85 44.45,38.1 JP7.D3
D4  (via drill 0.38)
  Top 0.203: U4.13 40.85,35.64 v42.93,37.72
  Bottom 0.203: v42.93,37.72 42.93,47.24 41.91,48.26 JP7.D4
D5
  Top 0.203: JP7.D5 39.37,41.78 35.35,37.76 U4.24
D6
  Top 0.203: U4.29 34.79,31.23 34.92,31.37 34.92,37.97 36.83,39.88 JP7.D6
D7  (via drill 0.38)
  Top 0.203: U4.30 35.3,30.73 35.69,31.11 v35.69,33.27 | v34.29,39.37 JP7.D7
  Bottom 0.203: v35.69,33.27 34.29,34.67 v34.29,39.37
D8  (via drill 0.38)
  Top 0.203: U4.11 43.11,32.73 43.66,33.29 43.66,34.85 v43.13,35.38
  Bottom 0.203: v43.13,35.38 30.23,48.28 JP7.D8
D9  (via drill 0.38)
  Top 0.203: U4.12 42.35,34.33 v42.16,34.52
  Bottom 0.203: v42.16,34.52 27.69,49 JP7.D9
D10  (via drill 0.38)
  Top 0.203: U4.27 31.65,32.23 v25.15,38.73
  Bottom 0.203: v25.15,38.73 JP7.D10
D11
  Top 0.203: U4.25 32.81,33.23 22.61,43.43 JP7.D11
D12  (via drill 0.38)
  Top 0.203: U4.28 31.01,31.73 20.07,42.67 v20.07,42.93
  Bottom 0.203: v20.07,42.93 JP7.D12
D13  (via drill 0.38)
  Top 0.203: U4.26 32.29,32.73 v32,33.02 17.53,47.5 JP7.D13 | 8.56,31.75 Q2.1 9.16,31.73 9.36,31.54 R12.2 13.12,28.57 14.61,28.57 v19.18,28.57
  Bottom 0.203: v19.18,28.57 24,23.75 30.1,23.75 34.29,27.94 34.92,27.94 36.07,29.08 36.07,29.97 35.69,30.35 35.69,31.62 35.31,32 33.02,32 v32,33.02
GND  (via drill 0.38)
  Top 0.203: C12.2 38.77,36.23 38.35,35.81 U4.18 38.35,33.52 v37.97,33.15
  Top 0.254: 44.83,28.07 46.86,28.07 v46.99,27.94 | v37.97,33.15 37.97,31.56 34.64,28.23 U4.35 26.51,28.23 v26.04,28.7 | v37.97,28.7 37.97,27.18 37.85,27.05 U4.42 37.85,25.28 37.47,24.89 C10.2 | 43.42,29.73 U4.5 41.39,29.73 40.64,30.48
  Top 0.279: 43.42,29.73 43.56,29.59 43.56,29.21 | C6.2 44.58,28.32 44.83,28.07
  Top 0.406: JP2.GND1 3.84,39.34 3.81,39.37 | 5.62,39.34 6.48,38.48
  Bottom 0.254: SJ2.1 3.81,34.92 2.29,36.45 v2.29,36.89
  other vias: 29.4,26.54 41.85,22.86 45.09,22.03 2.29,40.64 2.29,44.26 36.45,21.72 11.68,41.91 28,24.64 17.72,40.64 17.78,10.16 10.03,36.13 9.02,40.07 31.75,21.59 35.31,29.34 39.62,31.75
  pour Top (isolate 0.305): 0,53.34 0,0 57.15,0 57.15,53.34
  pour Bottom (isolate 0.305): 0,53.34 0,0 57.15,0 57.15,53.34
N$1
  Top 0.406: JP2.VBUS1 7.46,41.94 F1.1
N$2
  Top 0.254: C9.2 43.81,26.02 Y1.P$2 43.84,27.29 43.39,27.73 U4.1
N$3
  Top 0.203: D4.C Q2.3
N$4
  Top 0.254: C7.1 46.35,26.02 Y1.P$1 46.34,27.2 45.97,27.56 44.22,27.56 43.55,28.23 U4.2
N$5
  Top 0.203: D3.A 1.66,33.68 R7.1
N$6
  Top 0.203: D4.A 1.66,31.14 R8.1
N$8
  Top 0.203: D2.C 7.62,24.77 9.53,22.86 R6.1
N$10
  Top 0.203: D5.A 1.66,28.6 R9.1
N$11
  Top 0.203: D6.A 1.66,26.06 R10.1
N$12  (via drill 0.38)
  Top 0.203: D3.C 3.42,35.8 v4.32,36.7
  Bottom 0.254: v4.32,36.7 5.59,35.43 SJ2.2
N$13  (via drill 0.38)
  Top 0.254: R1.2 v23.15,16.93
  Bottom 0.254: v23.15,16.93 22.81,17.27 SJ1.1
N$15
  Top 0.254: U1.5 19.7,18.39 R3.2
  Bottom 0.254: SJ1.2 R3.2
PA13  (via drill 0.38)
  Top 0.203: U4.22 36.35,33.75 36.58,33.53 36.58,31.62 v36.45,31.5
  Bottom 0.203: JP5.5 32.64,18.67 32.64,25.02 36.45,28.83 v36.45,31.5
PB22  (via drill 0.38)
  Top 0.203: U4.37 34.99,26.23 v33.53,24.77
  Bottom 0.203: v33.53,24.77 33.53,17.02 JP5.4
PB23  (via drill 0.38)
  Top 0.203: U4.38 35.85,25.05 35.43,24.64 v34.67,24.64
  Bottom 0.203: v34.67,24.64 34.67,15.62 JP5.3
RX_LED  (via drill 0.38)
  Top 0.203: U4.48 40.85,25.19 41.02,25.02 42.55,25.02 42.93,24.64 42.93,22.61 40.64,20.32 v25.15,20.32 | v19.3,25.4 10.16,25.4 8.26,27.3 D6.C
  Bottom 0.203: v25.15,20.32 20.07,25.4 v19.3,25.4
SCL
  Top 0.203: JP7.SCL 11.84,46.33 14.63,46.33 31.23,29.73 U4.32
SDA
  Top 0.203: JP7.SDA 13.84,46.86 14.86,46.86 31.49,30.23 U4.31
SPI_MISO
  Top 0.203: JP7.MISO 50.39,30.43 50.24,30.58 50.24,35.87 46.91,39.19 38.18,39.19 37.13,38.15 37.13,36.02 36.85,35.73 U4.21
SPI_MOSI
  Top 0.203: U4.19 37.85,37.85 38.48,38.48 46.61,38.48 49.53,35.56 49.53,28.57 51.44,26.67 53.53,26.67 JP7.MOSI
SPI_SCK
  Top 0.203: JP7.SCK 51.36,27.89 49.89,29.36 49.89,35.71 46.76,38.84 38.33,38.84 37.49,38 37.49,35.87 37.35,35.72 U4.20
SWCLK  (via drill 0.38)
  Top 0.203: U4.45 39.35,27.54 v39.62,27.81 | JP6.4 39.88,16 39.88,12.7 38.99,11.81 33.4,11.81 JP5.2
  Bottom 0.203: v39.62,27.81 39.62,18.03 JP6.4
SWDIO  (via drill 0.38)
  Top 0.203: U4.46 39.85,27.02 40.32,27.5 40.32,28.26 v39.69,28.89 | JP6.2 40.26,16.89 40.26,12.45 37.97,10.16 JP5.1
  Bottom 0.203: JP6.2 38.73,27.94 v39.69,28.89
TX_LED  (via drill 0.38)
  Top 0.203: v25.65,22.61 34.04,22.61 36.35,24.92 U4.39 | v19.3,26.67 11.43,26.67 8.26,29.84 D5.C
  Bottom 0.203: v25.65,22.61 23.62,22.61 19.56,26.67 v19.3,26.67
USB_D+
  Top 0.203: JP2.D+1 6.2,40.64 8.61,38.23 18.9,38.23 28.39,28.73 U4.34
USB_D-
  Top 0.203: U4.33 28.55,29.23 19.04,38.75 8.62,38.75 6.08,41.29 JP2.D-1
USB_HOST_EN  (via drill 0.38)
  Top 0.203: U4.41 37.35,27.13 37.59,27.37 37.59,28.07 37.21,28.45 36.26,28.45 33.34,25.53 24.51,25.53 v21.21,28.83 | v21.21,32.26 21.21,33.4 17.78,36.83 R2.1
  Bottom 0.203: v21.21,28.83 v21.21,32.26
USB_HOST_POWER_EN  (via drill 0.38)
  Top 0.254: U2.4 v17.91,32.07 | v11.94,39.62 12.1,39.62 R5.1 13.12,42.08 Q1.1
  Bottom 0.254: v11.94,39.62 8,43.56 4.19,43.56 3.3,42.67 3.3,40.13 3.68,39.75 4.57,39.75 12.25,32.07 v17.91,32.07
USB_ID
  Top 0.203: 12.7,35.56 10.81,37.45 8.4,37.45 5.86,39.99 JP2.ID1 | 12.7,35.56 12.7,33.97 | 12.7,33.97 12.7,33.4 13.08,33.02 U2.2 | U2.1 12.7,33.97 | R4.1 12.7,35.56
  Top 0.254: R4.1 R2.2
VBAT
  Top 0.203: JP8.2 JP4.2
  Top 0.406: U1.3 16.83,21.27 16.51,21.59 15.24,21.59 | 15.24,21.59 14.35,21.59 12.96,20.2 D1.A 12.68,20.18 12.08,20.18 11.81,20.45 JP9.2 10.03,20.45 9.76,20.18 JP4.2 | C2.1 15.24,21.59
VDDANA
  Top 0.279: U4.6 44.07,30.23 44.54,30.7 C6.1 L1.2
VDDCORE
  Top 0.254: U4.43 38.35,22.86 38.14,22.64 C10.1
VIN  (via drill 0.38)
  Top 0.203: D2.A 1.66,24.12 1.91,23.88 v4.83,23.88
  Top 0.254: R5.2 v16.51,40.64 | U2.5 17.33,33.97 17.65,34.29 v17.65,35.56 R4.2
  Top 0.406: Q1.2 16.24,42.18 16.51,41.91 v16.51,40.64 | 15.24,16.51 C4.1 16.83,16.61 U1.4 | C3.1 16.13,7.62 15.24,8.51 15.24,9.21 | 15.24,9.21 15.24,10.16 | 15.24,10.16 15.24,11.11 | U3.3 15.24,9.21 | 15.24,11.11 15.24,16.51 | U3.1 15.24,11.11 | JP3.PWR 15.24,10.16 | 15.24,16.51 v12.7,16.51 D1.C
  Bottom 0.203: v4.83,23.88 1.27,23.88 1.27,24.13
  Bottom 0.254: v17.65,35.56 16.51,36.7 v16.51,40.64
  Bottom 0.406: v16.51,40.64 11.68,40.64 6.6,45.72 2.54,45.72 1.27,44.45 1.27,24.13 1.27,17.78 2.54,16.51 v12.7,16.51 | JP1.2 3.05,13.21 7.73,13.21 JP3.PWR 15.86,5.08 31.75,5.08 JP7.VIN
VUSB  (via drill 0.38)
  Top 0.406: Q1.3 12.27,44.28 11.97,44.58 C1.1 8.89,44.58 | F1.2 8.89,44.58 | v8.89,45.97 8.89,44.58 | v25.4,6.35 26.67,5.08 JP7.5V
  Bottom 0.406: v25.4,6.35 17.78,6.35 13.97,10.16 13.97,11.43 11.43,13.97 3.17,13.97 0.64,16.51 0.64,44.83 2.29,46.48 8.38,46.48 v8.89,45.97

### Text on the board
Bottom: v10
tPlace: SCL | SDA | AREF | GND | D13 | D12 | D11 | D10 | D9 | D8 | D7 | D6 | D5 | D4 | D3 | D2 | TX/D1 | RX/D0 | ~ | ~ | ~ | ~ | ~ | ~ | ~ | ~ | ~ | ~ | Serial1 | POWER | 13 | 3V3 | TX | MISO | ATSAMD21G / R3 Breakout | SCK | MOSI | RX | CHARGE | !RST! | GND | 3.3V | SWDIO | Serial | GND | SWCLK | RESET | 5V | !RESET! | 38 | 30/TX | 31/RX | SWCLK | SWDIO | 5V | GND | IOREF | !RESET! | 3.3V | VUSB | GND | GND | VIN | A0/DAC | A1 | A2 | A3 | A4 | A5
bPlace: SCL | SDA | AREF | GND | D13 | D12 | D11 | D10 | D9 | D8 | D7 | D6 | D5 | D4 | D3 | D2 | TX/D1 | RX/D0 | ~ | ~ | ~ | ~ | ~ | ~ | ~ | ~ | ~ | ~ | PWR / LED | 3V3 | MISO | ATSAMD21G / R3 Breakout | SCK | MOSI | !RST! | GND | R-Prog | 3.3V | SWDIO | GND | SWCLK | 5V | !RESET! | 38 | 30/TX | 31/RX | SWCLK | SWDIO | GND | IOREF | !RESET! | 3.3V | VUSB | GND | GND | VIN | A0/DAC | A1 | A2 | A3 | A4 | A5
Measures: Units in inches
tDocu: Jim Lindblom